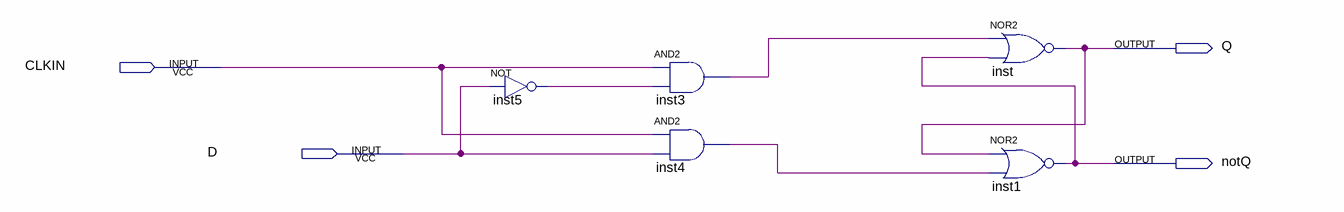
[diagram p0: schematic sheet]
// Quartus schematic D_latch.bdf as structural Verilog: 5 symbols, 4 pins
module D_latch (
  input  CLKIN,
  input  D,
  output Q,
  output notQ
);

  wire inst3_out, inst4_out, inst5_out;

  not inst5 (inst5_out, D);
  and inst3 (inst3_out, CLKIN, inst5_out);
  and inst4 (inst4_out, CLKIN, D);
  nor inst (Q, inst3_out, notQ);
  nor inst1 (notQ, Q, inst4_out);
endmodule
